# EAGLE design brd (EAGLE 6.4)
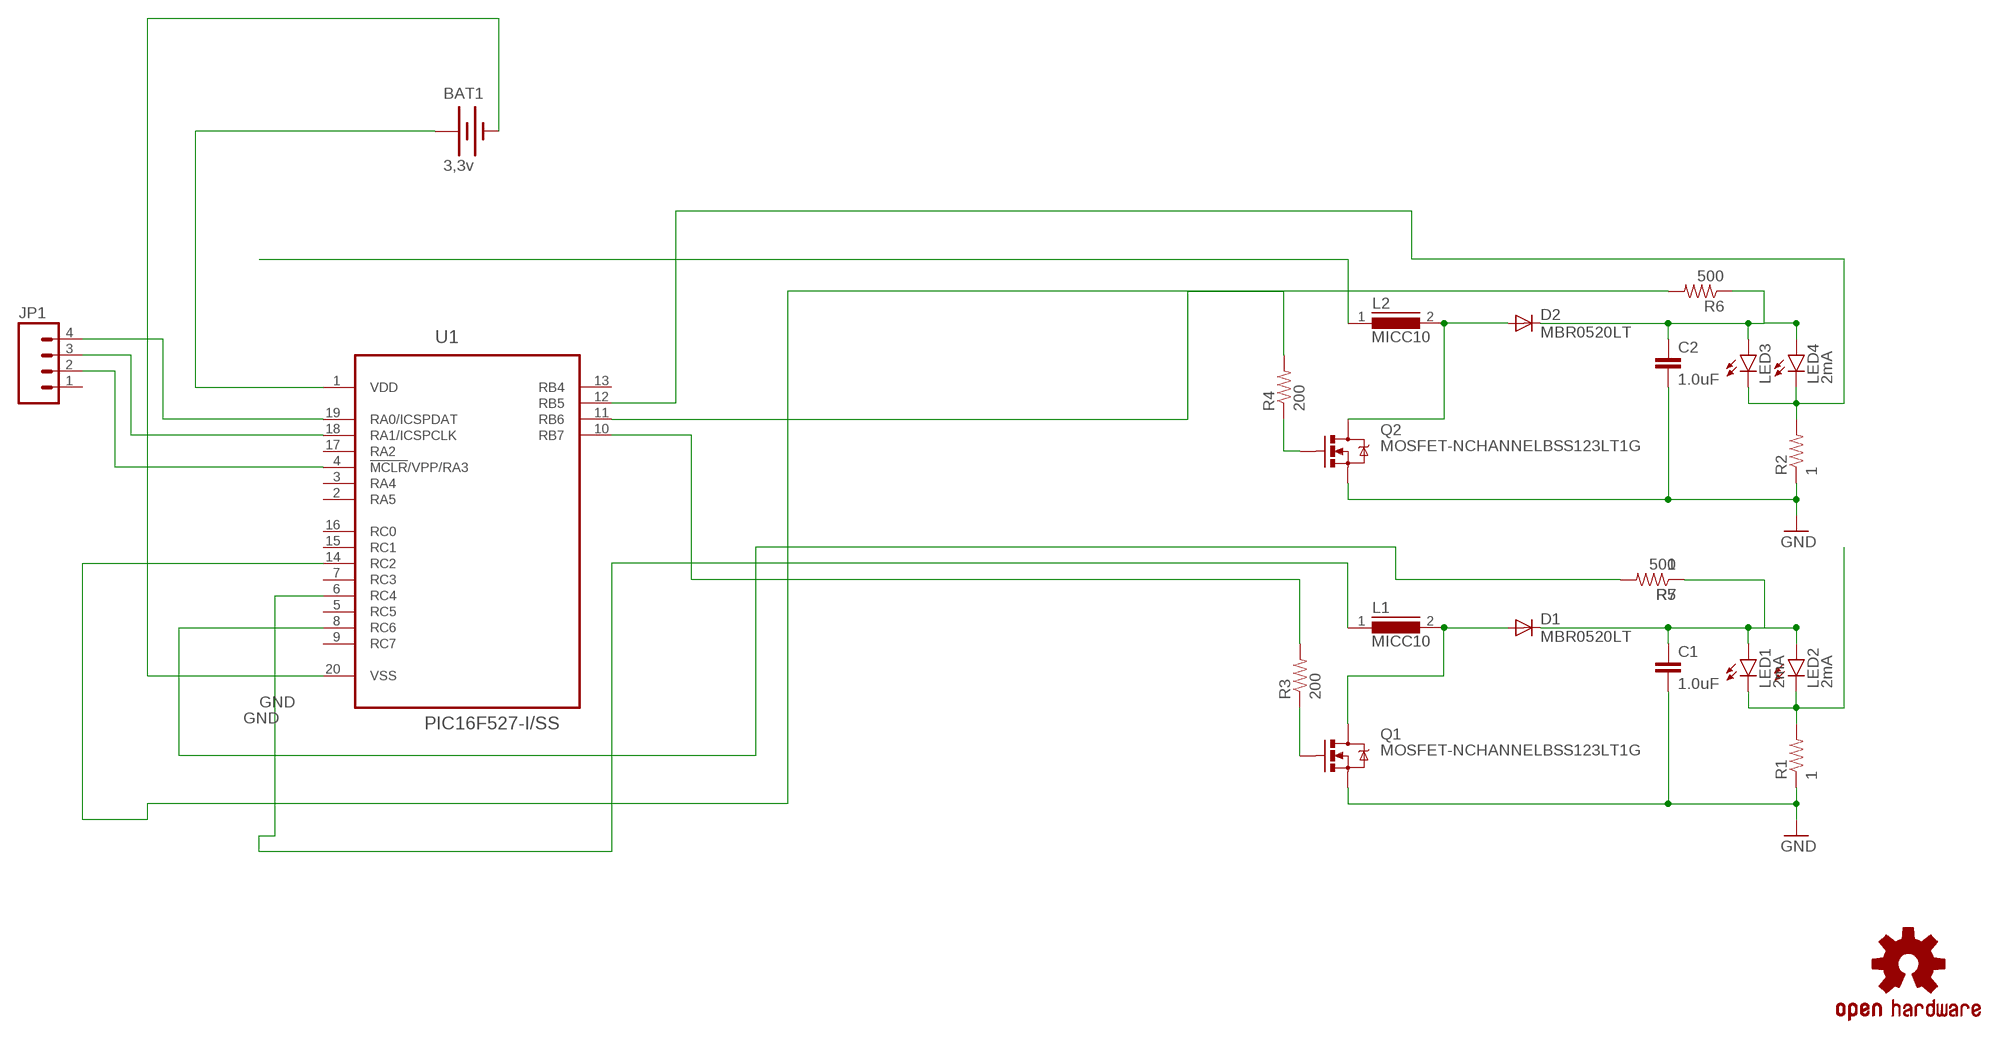
[diagram p0: schematic, sheet 1]

## Parts
BAT1  3,3v  BATTERY20SMD  [BATTCON_20MM]
C1  1.0uF  1.0UF-25V-+80/-20(0805)  [0805]
C2  1.0uF  1.0UF-25V-+80/-20(0805)  [0805]
D1  MBR0520LT  [SOD123]
D2  MBR0520LT  [SOD123]
JP1  M041.27MM  [1X04-1.27MM]
L1  MICC10  [MICC10]
L2  MICC10  [MICC10]
LED1  2mA  LED-3MM-NO_SILK  [LED3MM-NS]
LED2  2mA  LED-3MM-NO_SILK  [LED3MM-NS]
LED3  LED-3MM-NO_SILK  [LED3MM-NS]
LED4  2mA  LED-3MM-NO_SILK  [LED3MM-NS]
LOGO1  OSHW-LOGOM  [OSHW-LOGO-M]
Q1  MOSFET-NCHANNELBSS123LT1G  [SOT23]
Q2  MOSFET-NCHANNELBSS123LT1G  [SOT23]
R1  1  RESISTOR0805-RES  [0805]
R2  1  RESISTOR0805-RES  [0805]
R3  200  RESISTOR0805-RES  [0805]
R4  200  RESISTOR0805-RES  [0805]
R5  1  RESISTOR0805-RES  [0805]
R6  500  RESISTOR0805-RES  [0805]
R7  500  RESISTOR0805-RES  [0805]
U1  PIC16F527-I/SS  [SOP65P780X200-20N]

## Nets
GND: BAT1.2(-) C1.2 C2.2 Q1.2(S) Q2.2(S) R1.1 R2.1 U1.20(VSS)
N$1: D1.A L1.2 Q1.3(D)
N$2: R4.2 U1.11(RB6)
N$3: JP1.4 U1.19(RA0/ICSPDAT)
N$5: LED1.K(C) LED2.K(C) R1.2
N$6: D2.A L2.2 Q2.3(D)
N$7: L1.1 U1.6(RC4)
N$8: Q1.1(G) R3.1
N$9: Q2.1(G) R4.1
N$10: C2.1 D2.C LED3.A LED4.A R6.1
N$11: LED3.K(C) LED4.K(C) R2.2 U1.12(RB5)
N$12: JP1.3 U1.18(RA1/ICSPCLK)
N$13: R3.2 U1.10(RB7)
N$14: L2.1
N$16: JP1.2 U1.4(!MCLR!/VPP/RA3)
N$17: R5.2 R7.2 U1.8(RC6)
N$18: C1.1 D1.C LED1.A LED2.A R5.1 R7.1
N$19: R6.2 U1.14(RC2)
VDD: BAT1.1(+) U1.1(VDD)
Unconnected: JP1.1 U1.2(RA5) U1.3(RA4) U1.5(RC5) U1.7(RC3) U1.9(RC7) U1.13(RB4) U1.15(RC1) U1.16(RC0) U1.17(RA2)

## Library data of the parts
BAT1 = SparkFun-Electromechanical:BATTERY: Battery Holders Various common sizes : AA, AAA, 20mm coin cell and 12mm coin cell. 20MM_4LEGS, BATT-10373
C1 C2 = SparkFun-Capacitors:1.0UF-25V-+80/-20(0805): CAP-11625; PROD_ID: CAP-11625
D1 D2 = diode:MBR0520LT: SCHOTTKY BARRIER RECTIFIER Source: http://onsemi.com .. MBR0520LT1-D.pdf
JP1 = SparkFun-Connectors:M04: Header 4 Standard 4-pin 0.1" header. Use with straight break away headers (SKU : PRT-00116), right angle break away headers (PRT-00553), swiss pins (PRT-00743), machine pins (PRT-00117), and female headers (PRT-00115). Molex polarized connector foot print use with SKU : PRT-08231 with associated crimp pins and housings. 1MM SMD Version SKU: PRT-10208
L1 L2 = inductors:MICC10: INDUCTOR
LED1-LED4 = SparkFun-LED:LED: LEDs Standard schematic elements and footprints for 5mm, 3mm, 1206, and 0603 sized LEDs. 5mm - Spark Fun Electronics SKU : COM-00529 (and others)
LOGO1 = SparkFun-Aesthetics:OSHW-LOGO: Open Source Hardware Logo This logo indicates the piece of hardware it is found on incorporates a OSHW license and/or adheres to the definition of open source hardware found here: http://freedomdefined.org/OSHW
Q1 Q2 = SparkFun-DiscreteSemi:MOSFET-NCHANNEL: Common NMOSFET Parts MFG P/N Store ID Prod ID FDD8780 TRANS-09984 SI7820DN TRANS-11055 FDS6630A IC-08089 2N7002PW TRANS-11151 FQP30N06L COM-10213 TRANS-10060 BSS123LT1G TRANS-08345 BSS138 TRANS-00830 BS170 2N7000; PROD_ID: TRANS-08345
R1-R7 = SparkFun-Passives:RESISTOR: Resistor Basic schematic elements and footprints for 0603, 1206, and PTH resistors.
U1 = Pic2:PIC16F527-I/SS: 8-Bit Flash Microcontroller,SSOP-20; MPN: PIC16F527-I/SS; OC_FARNELL: 2301100; OC_NEWARK: 48W6621; PACKAGE: SSOP-20; SUPPLIER: MICROCHIP

## Board
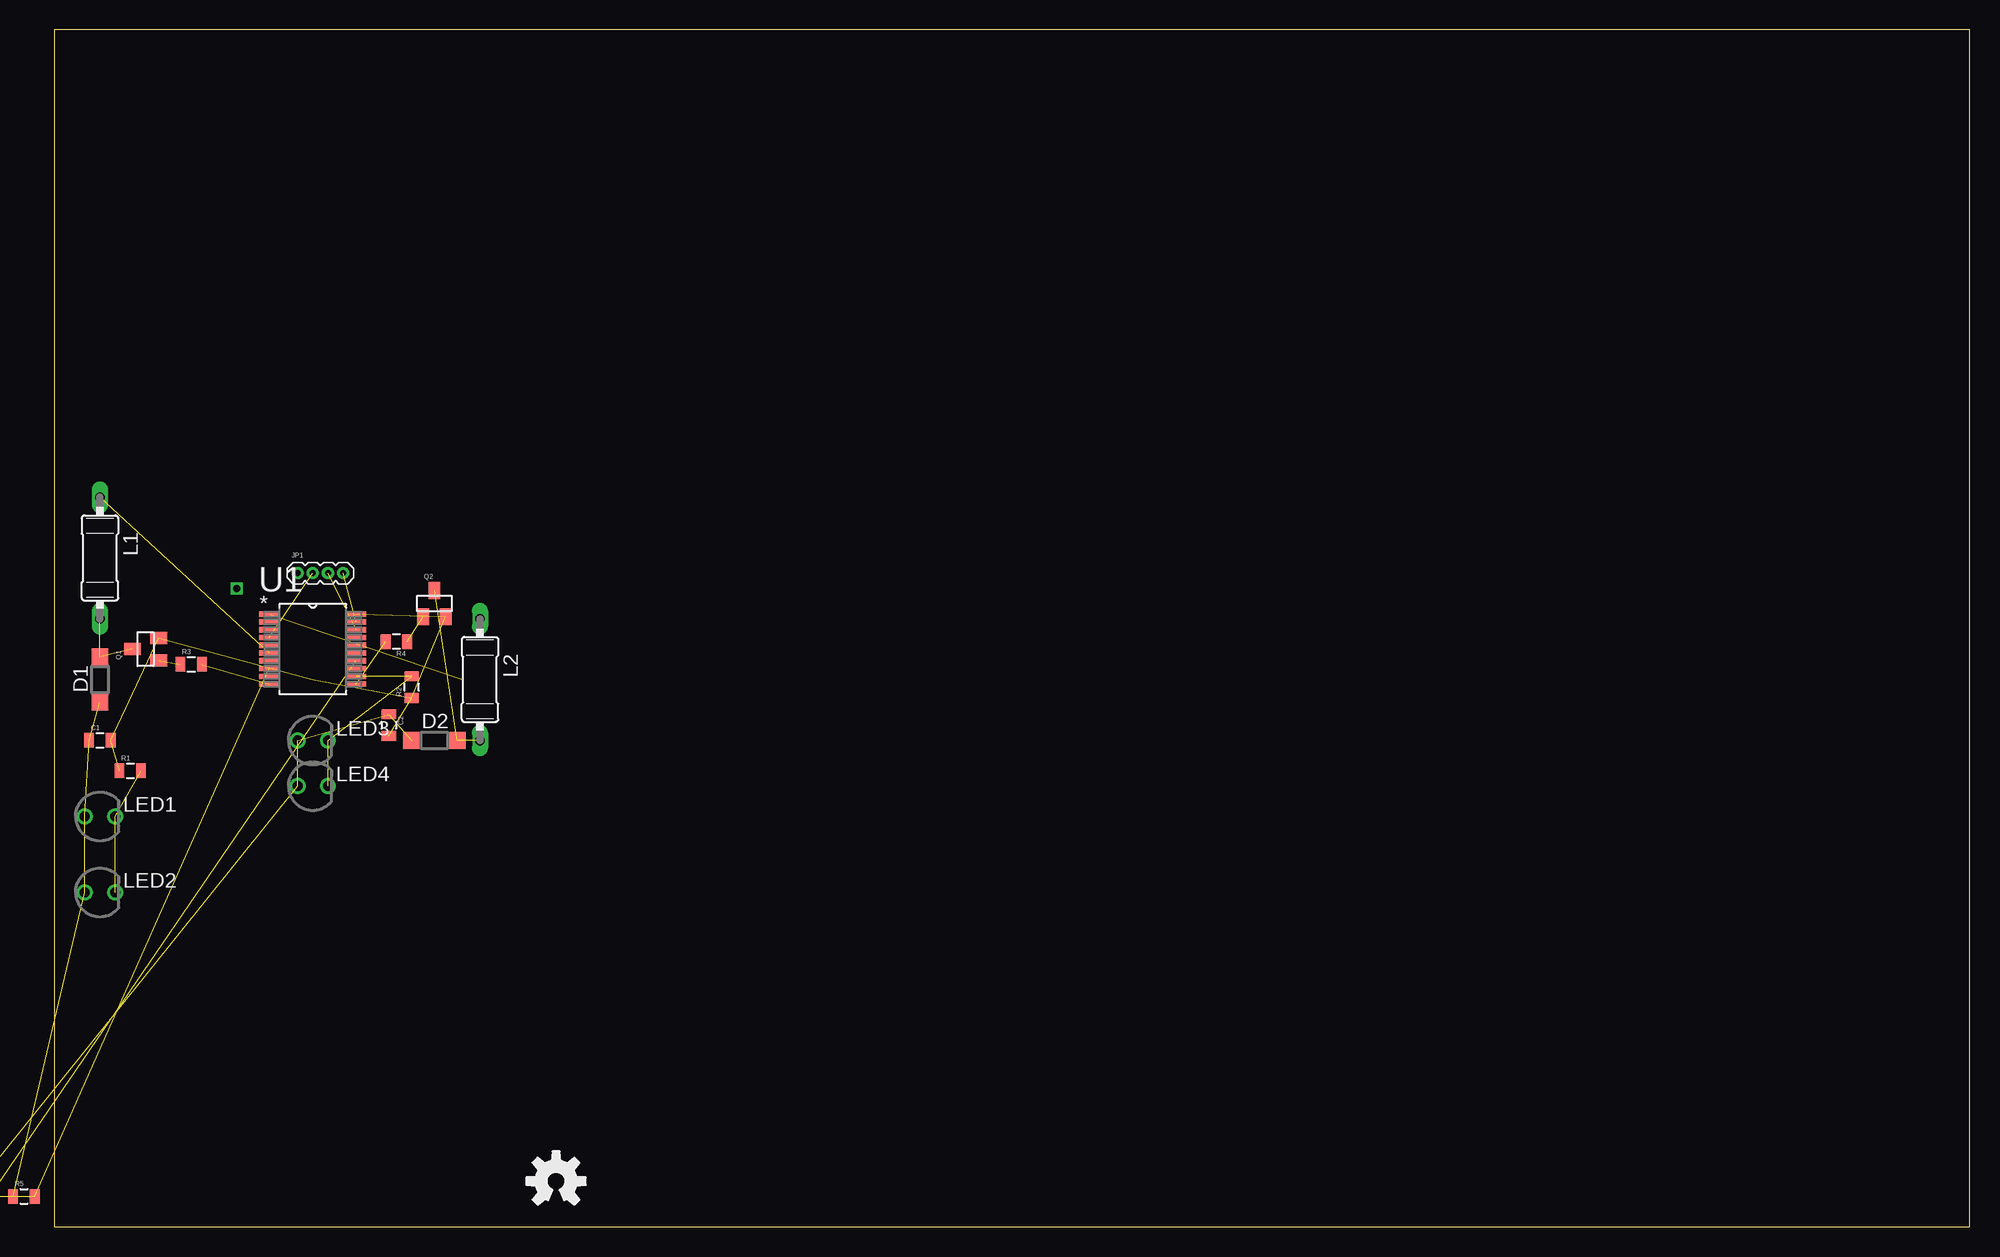
[diagram p1: board, top side]
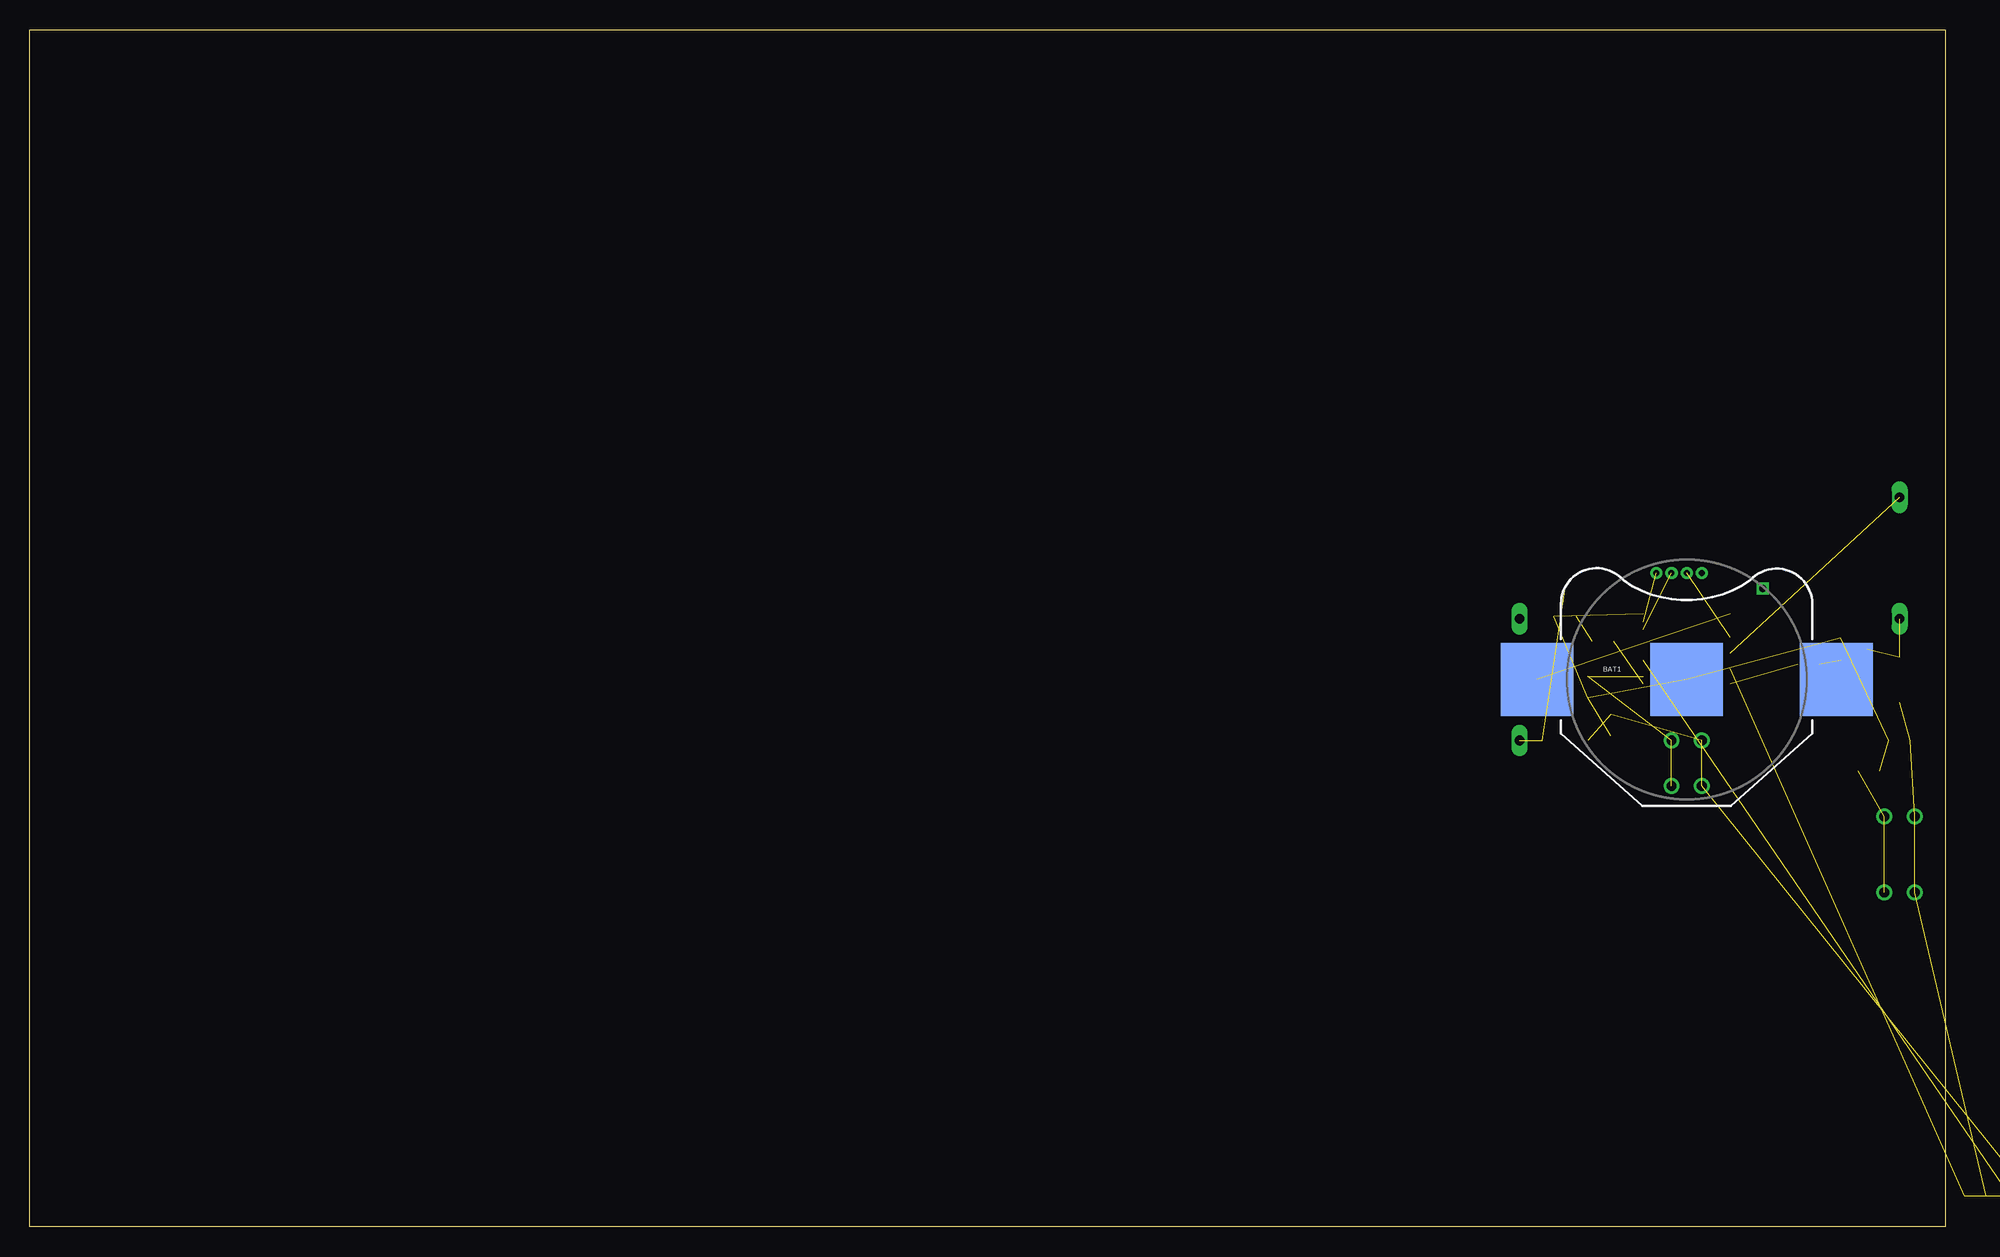
[diagram p2: board, bottom side, seen from below]

Size 160 x 100 mm. Coordinates in mm from the lower left corner, seen from the top.
Outline: 0,0 160,0 160,100 0,100 0,0
Copper layers (1*16): Top 0.035mm / dielectric 1.5mm / Bottom 0.035mm
Design rules "default": minimum track width 10mil, minimum drill 24mil, track to track 8mil, track to pad 8mil, pad to pad 8mil, via to via 8mil, smd to smd 8mil, copper to edge 40mil, drill to drill 8mil, minimum pad ring 10mil, minimum via ring 8mil, stop-mask expansion 4mil, vias tented up to drill 0mil, thermal gap 10mil

### Footprints (pad centres in the part's own frame; a part is rotated, then mirrored left to right if it is on the bottom)
BATTCON_20MM = smd 6.07 x 6.07: 1 -12.5,0; 2 0,0; 3 12.5,0
0805 = smd 0.8 x 1.2: 1 -0.9,0; 2 0.9,0
SOD123 = smd 1.4 x 1.4: A 1.9,0; C -1.9,0
1X04-1.27MM = drill 0.508 pad 1: 1 0,0; 2 1.27,0; 3 2.54,0; 4 3.81,0
MICC10 = drill 0.813 long: 1 -5.08,0; 2 5.08,0
LED3MM-NS = drill 0.813: A -1.27,0; K 1.27,0
SOT23 = smd 1 x 1.4: 1 -0.95,-1.1; 2 0.95,-1.1; 3 0,1.1
SOP65P780X200-20N = smd 1.651 x 0.432: 1 -3.632,2.921; 2 -3.632,2.286; 3 -3.632,1.626; 4 -3.632,0.965; 5 -3.632,0.33; 6 -3.632,-0.33; 7 -3.632,-0.965; 8 -3.632,-1.626; 9 -3.632,-2.286; 10 -3.632,-2.921; 11 3.632,-2.921; 12 3.632,-2.286; 13 3.632,-1.626; 14 3.632,-0.965; 15 3.632,-0.33; 16 3.632,0.33; 17 3.632,0.965; 18 3.632,1.626; 19 3.632,2.286; 20 3.632,2.921

### Placement (x,y rotation side)
BAT1  21.59,45.72 0 bottom
C1  3.81,40.64 0 top
C2  27.94,41.91 270 top
D1  3.81,45.72 90 top
D2  31.75,40.64 0 top
JP1  20.32,54.61 0 top
L1  3.81,55.88 270 top
L2  35.56,45.72 270 top
LED1  3.81,34.29 0 top
LED2  3.81,27.94 0 top
LED3  21.59,40.64 0 top
LED4  21.59,36.83 0 top
LOGO1  41.91,3.81 0 top
Q1  7.62,48.26 90 top
Q2  31.75,52.07 0 top
R1  6.35,38.1 0 top
R2  29.84,45.09 90 top
R3  11.43,46.99 0 top
R4  28.57,48.9 180 top
R5  -2.54,2.54 0 top
R6  -6.35,2.54 0 top  (outside the outline)
R7  -10.16,2.54 0 top  (outside the outline)
U1  21.59,48.26 0 top

### Tracks (layer width: path | path; a pad name or v marks a point on that pad's centre or on a via)
GND  (7 unrouted)
N$1  (2 unrouted)
N$2  (1 unrouted)
N$3  (1 unrouted)
N$5  (2 unrouted)
N$6  (2 unrouted)
N$7  (1 unrouted)
N$8  (1 unrouted)
N$9  (1 unrouted)
N$10  (4 unrouted)
N$11  (3 unrouted)
N$12  (1 unrouted)
N$13  (1 unrouted)
N$15  (via drill 0.6)
  other vias: 15.24,53.34
N$16  (1 unrouted)
N$17  (2 unrouted)
N$18  (5 unrouted)
N$19  (1 unrouted)
VDD  (1 unrouted)